# Altium schematic sheet INA226-Current-Sensors.SchDoc: INA226 Current Sensors
size Letter; Author: Tharun Suresh; CompanyName: AlbertaSat; Organization: Altium Limited; Revision: 4.1; SheetNumber: 4; SheetTotal: 4; CopyrightYear: 2019
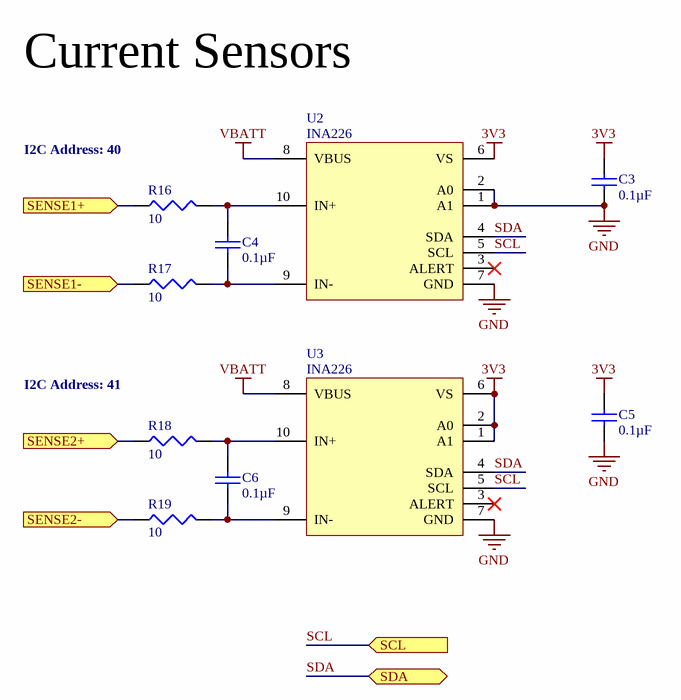
[diagram p0: INA226-Current-Sensors.SchDoc]

## Parts
C3  value 0.1µF  [TDK-CGA2B]  (hidden comment: Cap)
C4  value 0.1µF  [TDK-CGA5L]  (hidden comment: Cap)
C5  value 0.1µF  [TDK-CGA2B]  (hidden comment: Cap)
C6  value 0.1µF  [TDK-CGA5L]  (hidden comment: Cap)
R16  value 10  [PANA-ERA2A]  (hidden comment: Res3)
R17  value 10  [PANA-ERA2A]  (hidden comment: Res3)
R18  value 10  [PANA-ERA2A]  (hidden comment: Res3)
R19  value 10  [PANA-ERA2A]  (hidden comment: Res3)
U2  INA226  [TI-DGS]
U3  INA226  [TI-DGS]

## Ports
SCL (in), SDA (bidir), SENSE1+ (in), SENSE1- (in), SENSE2+ (in), SENSE2- (in)

## Nets
3V3: C3.2 C5.2 U2.6(VS) U3.1(A1) U3.2(A0) U3.6(VS)
GND: C3.1 C5.1 U2.1(A1) U2.2(A0) U2.7(GND) U3.7(GND)
VBATT: U2.8(VBUS) U3.8(VBUS)
SCL: U2.5(SCL) U3.5(SCL) ; port SCL
SDA: U2.4(SDA) U3.4(SDA) ; port SDA
SENSE1+: R16.1 ; port SENSE1+
SENSE1-: R17.1 ; port SENSE1-
SENSE2+: R18.1 ; port SENSE2+
SENSE2-: R19.1 ; port SENSE2-
NetC4_1: C4.1 R17.2 U2.9(IN-)
NetC4_2: C4.2 R16.2 U2.10(IN+)
NetC6_1: C6.1 R19.2 U3.9(IN-)
NetC6_2: C6.2 R18.2 U3.10(IN+)

Not connected (* = marked no-connect by the designer): U2 3(ALERT)*; U3 3(ALERT)*

## Notes on the sheet
- Current Sensors
- (near R16) I2C Address: 40
- (near R18) I2C Address: 41
- (the "License"); you may not use or redistribute this file except in compliance with the License. You
- This file and the information within it are licensed under the terms of the Apache License, Version 2.0
- Copyright
- Unless required by applicable law or agreed to in writing, content distributed under the License is
- distributed on an "AS IS" BASIS, WITHOUT WARRANTIES OR CONDITIONS OF ANY KIND,
- either express or implied. See the License for the specific language governing permissions and
- limitations under the License.
- may obtain a copy of the License at:
- http://www.apache.org/licenses/LICENSE-2.0
- Title
- Size:
- Date:
- Letter
- Number:
- Time:
- Revision:
- Sheet
- of
- University of Alberta
- Deptartment of Electrical
- and Computer Engineering
- Edmonton AB, Canada
- T6G 1H9
- File:

## Library data of the parts
C3 C5 = PC-TDK-02262: CAP CER 0.1UF 50V X7R 0402; Manufacturer Part Number: CGA2B3X7R1H104M050BB; Index: 2262; Designator: C?; Tolerance: ±20%; Published: 3/16/2016; LatestRevisionDate: 3/16/2016; LatestRevisionNote: ...; PackageReference: 0402 (1005 Metric); Publisher: AlbertaSat; PackageDescription: Radial Cap, Thru-Hole; 2 Leads; 0.3 in Pin Spacing; Part Number: PC-TDK-02262; Supplier Part Number 1: 445-12271-1-ND; Supplier 1: Digi-key; Supplier Link: http://www.digikey.ca/product-search/en?keywords=445-12271-1-ND; Voltage - Rated: 50V; Temperature Coefficient: X7R; Applications: Automotive
C4 C6 = PC-TDK-02295: CAP CER 0.1UF 50V NP0 1206; Manufacturer Part Number: CGA5L2NP01H104J160AA; Index: 2295; Tolerance: ±5%; Published: 3/16/2016; LatestRevisionDate: 3/16/2016; LatestRevisionNote: ...; PackageReference: 1206 (3216 Metric); Publisher: AlbertaSat; PackageDescription: Radial Cap, Thru-Hole; 2 Leads; 0.3 in Pin Spacing; Part Number: PC-TDK-02295; Supplier Part Number 1: 445-12839-1-ND; Supplier 1: Digi-key; Supplier Link: http://www.digikey.ca/product-search/en?keywords=445-12839-1-ND; Voltage - Rated: 50V; Temperature Coefficient: NP0; Applications: Automotive
R16-R19 = 13235: RES SMD 10 OHM 0.5% 1/16W 0402; Part Number: 13235; Manufacturer Part Number: ERA-2AKD100X; Designator: R?; Power: 0.063W, 1/16W; Temperature Coefficient: ±100ppm/°C; Published: 8-Jun-2000; LatestRevisionDate: 29-May-2009; LatestRevisionNote: IPC-7351 Footprint Added.; PackageReference: 0402 (1005 Metric); Publisher: Altium Limited; PackageDescription: Chip Resistor, 2-Leads, Body 1.00x0.50mm, IPC Low Density; Supplier Part Number 1: P10DDCT-ND; Supplier 1: Digi-Key; Supplier Link: http://www.digikey.ca/product-search/en?keywords=P10DDCT-ND; Tolerance: ±0.5%
U2 U3 = 19: IC MONITOR PWR/CURR BIDIR 10MSOP; Part Number: 19; Manufacturer Part Number: INA226AQDGSRQ1; Designator: U?; Supplier Link: https://www.digikey.com/product-detail/en/texas-instruments/INA226AQDGSRQ1/296-42503-1-ND/5416001; PackageReference: TI-MSOP10; Supplier 1: Digi-Key; Supplier Part Number 1: 296-42503-1-ND; Supplier 2: Mouser; Supplier Part Number 2: 595-INA226AQDGSRQ1